# Altium project 2015_CNC.PrjPcb
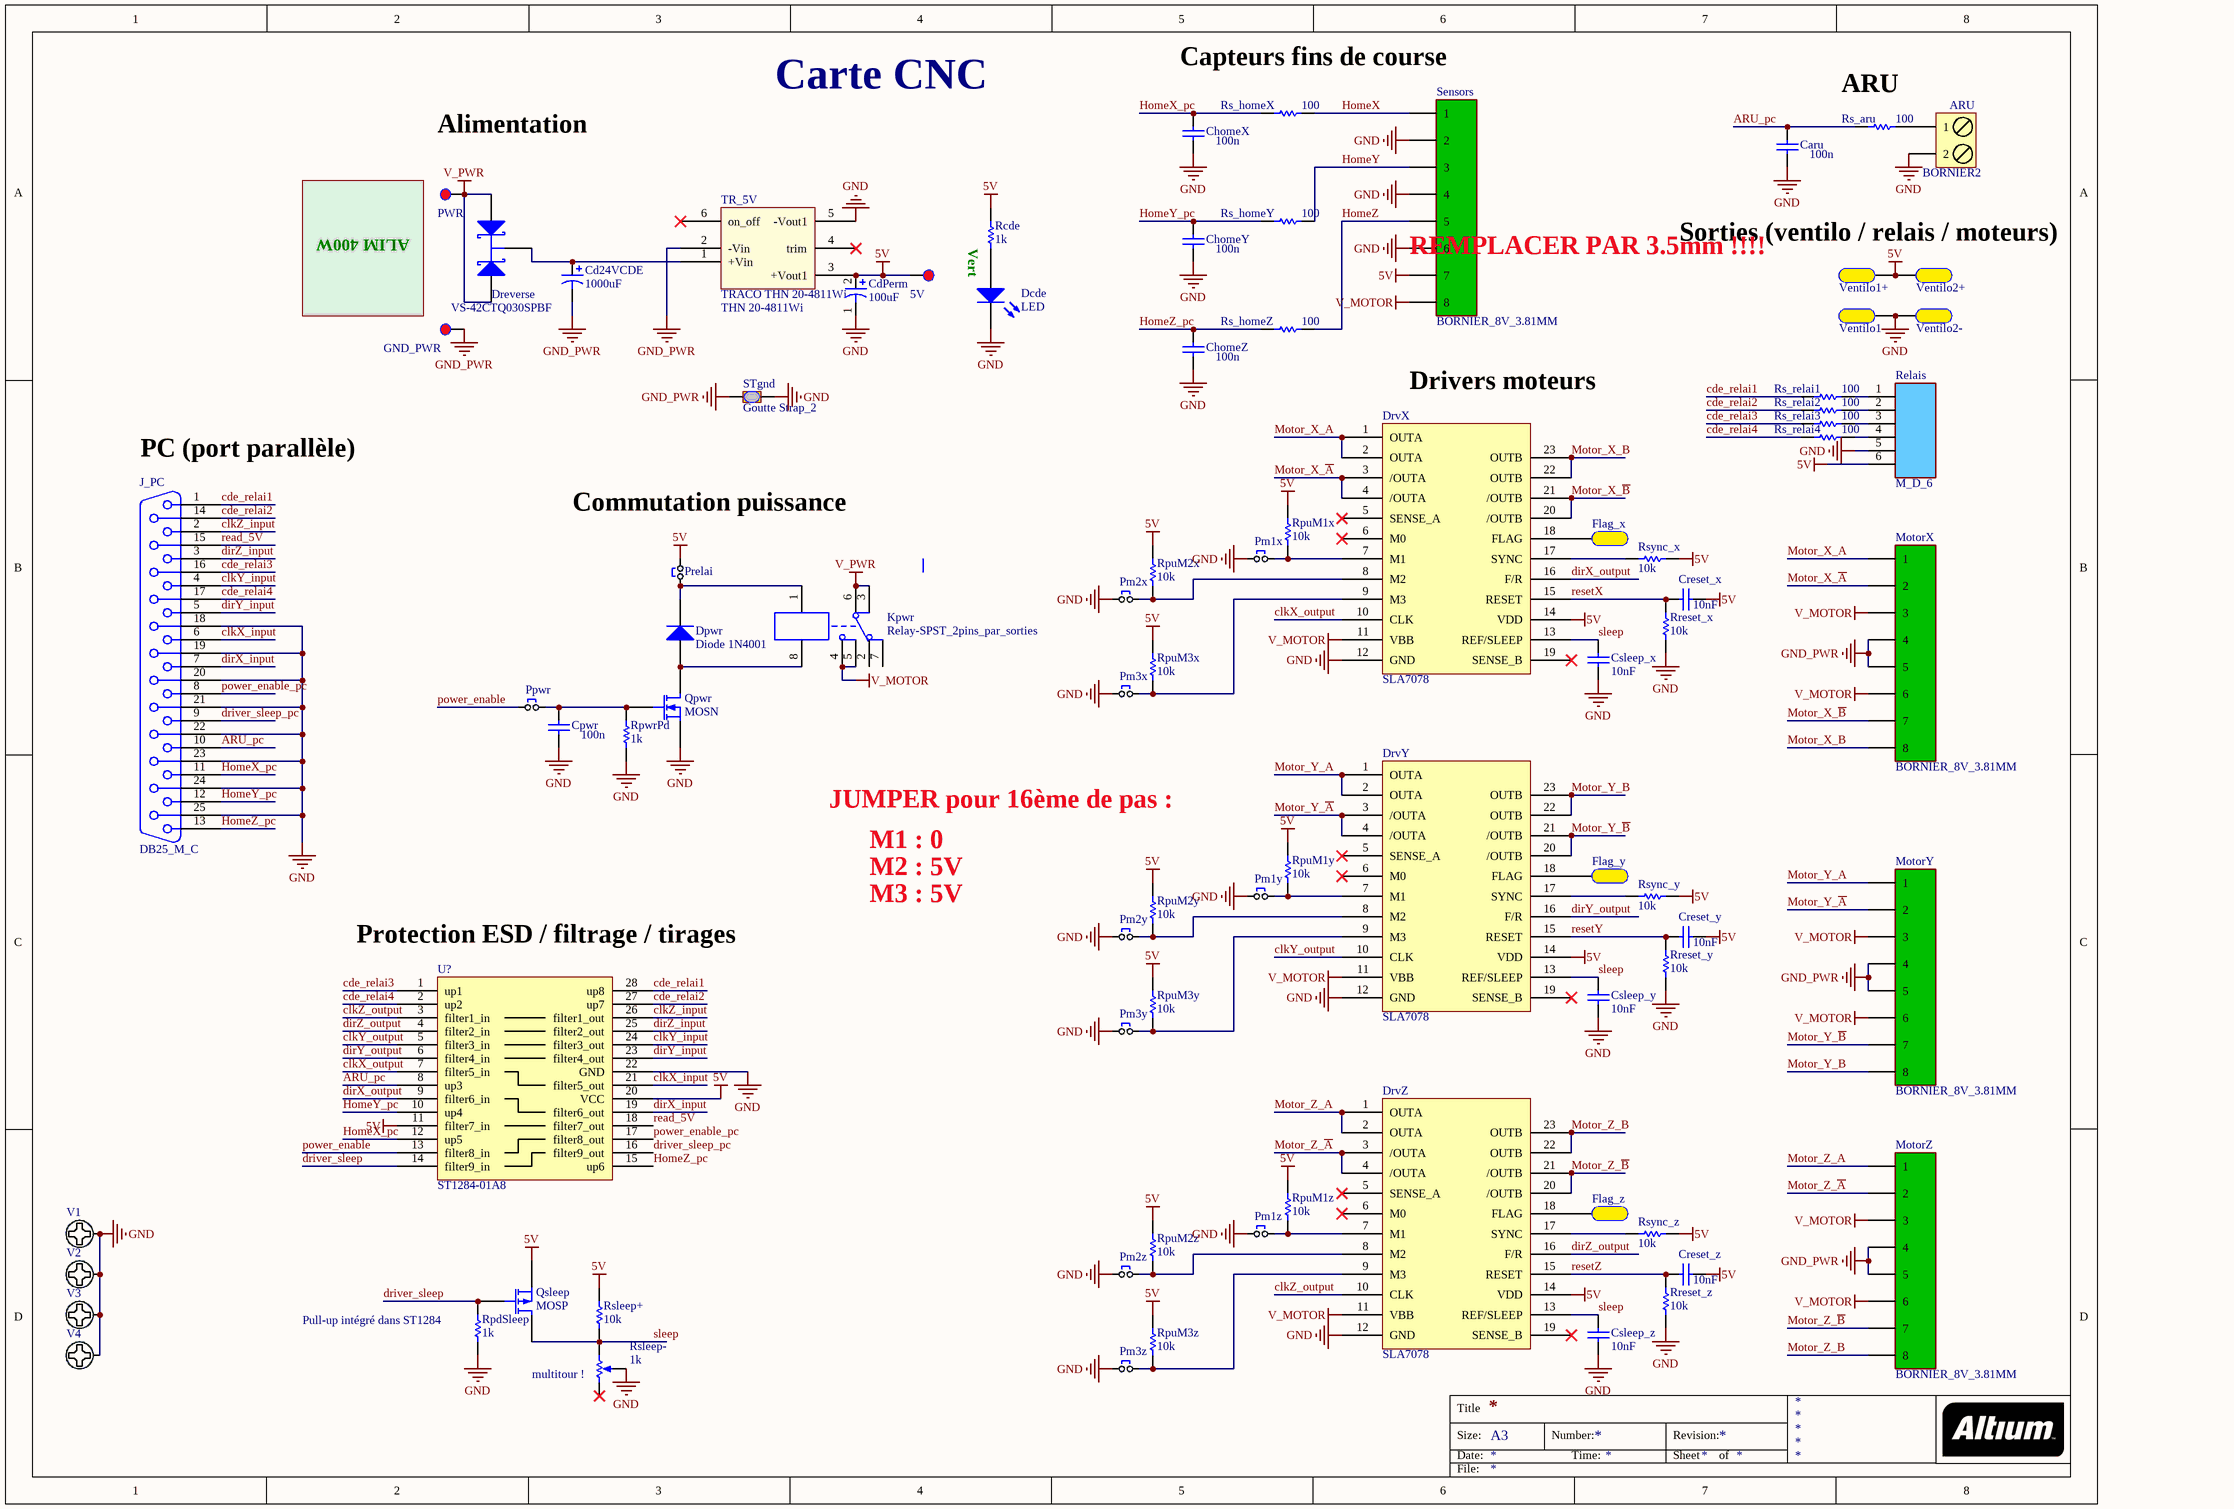
[diagram p0: 2015_CNC.SchDoc]
1 sheet, 85 parts. Net scope: global (net labels, ports and power ports of the same name join across sheets).
Board file: 2015_CNC.PcbDoc

## Sheet 2015_CNC.SchDoc
size A3

### Parts
5V  Name  [Point Test_D3_P1.6mm]  (value not drawn)
ARU  BORNIER2  [BORNIER2]
Caru  value 100n  [C0805_N]  (hidden comment: CMS_0805)
Cd24VCDE  1000uF  [RESISTANCE_5W]
CdPerm  100uF  [CONDENSATEUR_POLARISE_ELECTROLYTIQUE_RADIAL_5.08/8.9]
ChomeX  value 100n  [C0805_N]  (hidden comment: CMS_0805)
ChomeY  value 100n  [C0805_N]  (hidden comment: CMS_0805)
ChomeZ  value 100n  [C0805_N]  (hidden comment: CMS_0805)
Cpwr  value 100n  [C0805_N]  (hidden comment: CMS_0805)
Creset_x  value 10nF  [C0805_N]  (hidden comment: CMS_0805)
Creset_y  value 10nF  [C0805_N]  (hidden comment: CMS_0805)
Creset_z  value 10nF  [C0805_N]  (hidden comment: CMS_0805)
Csleep_x  value 10nF  [C0805_N]  (hidden comment: CMS_0805)
Csleep_y  value 10nF  [C0805_N]  (hidden comment: CMS_0805)
Csleep_z  value 10nF  [C0805_N]  (hidden comment: CMS_0805)
Dcde  LED  [LED_3mm]
Dpwr  Diode 1N4001  [DO-41]
Dreverse  VS-42CTQ030SPBF  [D2Pak (123)]
DrvX  SLA7078  [SLA23]
DrvY  SLA7078  [SLA23]
DrvZ  SLA7078  [SLA23]
Flag_x  Pad_CMS  [PAD_CMS_5.08x2.54]  (value not drawn)
Flag_y  Pad_CMS  [PAD_CMS_5.08x2.54]  (value not drawn)
Flag_z  Pad_CMS  [PAD_CMS_5.08x2.54]  (value not drawn)
GND_PWR  Name  [Point Test_D3_P1.6mm]  (value not drawn)
J_PC  Type: DB25_M_C  [SUBD25_M_C]  (hidden comment: SUBD25_MALE_COUDE)
Kpwr  Relay-SPST_2pins_par_sorties  [RELAY_TECONNECTIVITY]
MotorX  BORNIER_8V_3.81MM  [BORNIER_8V_3.81MM]
MotorY  BORNIER_8V_3.81MM  [BORNIER_8V_3.81MM]
MotorZ  BORNIER_8V_3.81MM  [BORNIER_8V_3.81MM]
Pm1x  Jumper SIP 2.54  [HDR1X2]  (value not drawn)
Pm1y  Jumper SIP 2.54  [HDR1X2]  (value not drawn)
Pm1z  Jumper SIP 2.54  [HDR1X2]  (value not drawn)
Pm2x  Jumper SIP 2.54  [HDR1X2]  (value not drawn)
Pm2y  Jumper SIP 2.54  [HDR1X2]  (value not drawn)
Pm2z  Jumper SIP 2.54  [HDR1X2]  (value not drawn)
Pm3x  Jumper SIP 2.54  [HDR1X2]  (value not drawn)
Pm3y  Jumper SIP 2.54  [HDR1X2]  (value not drawn)
Pm3z  Jumper SIP 2.54  [HDR1X2]  (value not drawn)
Ppwr  Jumper SIP 2.54  [HDR1X2]  (value not drawn)
Prelai  Jumper SIP 2.54  [HDR1X2]  (value not drawn)
PWR  Name  [Point Test_D3_P1.6mm]  (value not drawn)
Qpwr  MOSN  [SOT23-3N]
Qsleep  MOSP  [SOT23-3N]
Rcde  1k  [R1206_N]
Relais  Type: M_D_6  [HE10/6_MAL_DROIT_BAS PROFIL]  (hidden comment: BARRETTE_6 CONTACTS_1 RANGEE_MALE_DROITE)
RpdSleep  value 1k  [R1206_N]  (hidden comment: RESISTANCE_CMS_1206)
RpuM1x  value 10k  [R1206_N]  (hidden comment: RESISTANCE_CMS_1206)
RpuM1y  value 10k  [R1206_N]  (hidden comment: RESISTANCE_CMS_1206)
RpuM1z  value 10k  [R1206_N]  (hidden comment: RESISTANCE_CMS_1206)
RpuM2x  value 10k  [R1206_N]  (hidden comment: RESISTANCE_CMS_1206)
RpuM2y  value 10k  [R1206_N]  (hidden comment: RESISTANCE_CMS_1206)
RpuM2z  value 10k  [R1206_N]  (hidden comment: RESISTANCE_CMS_1206)
RpuM3x  value 10k  [R1206_N]  (hidden comment: RESISTANCE_CMS_1206)
RpuM3y  value 10k  [R1206_N]  (hidden comment: RESISTANCE_CMS_1206)
RpuM3z  value 10k  [R1206_N]  (hidden comment: RESISTANCE_CMS_1206)
RpwrPd  value 1k  [R1206_N]  (hidden comment: RESISTANCE_CMS_1206)
Rreset_x  value 10k  [R1206_N]  (hidden comment: RESISTANCE_CMS_1206)
Rreset_y  value 10k  [R1206_N]  (hidden comment: RESISTANCE_CMS_1206)
Rreset_z  value 10k  [R1206_N]  (hidden comment: RESISTANCE_CMS_1206)
Rs_aru  value 100  [R1206_N]  (hidden comment: RESISTANCE_CMS_1206)
Rs_homeX  value 100  [R1206_N]  (hidden comment: RESISTANCE_CMS_1206)
Rs_homeY  value 100  [R1206_N]  (hidden comment: RESISTANCE_CMS_1206)
Rs_homeZ  value 100  [R1206_N]  (hidden comment: RESISTANCE_CMS_1206)
Rs_relai1  value 100  [R1206_N]  (hidden comment: RESISTANCE_CMS_1206)
Rs_relai2  value 100  [R1206_N]  (hidden comment: RESISTANCE_CMS_1206)
Rs_relai3  value 100  [R1206_N]  (hidden comment: RESISTANCE_CMS_1206)
Rs_relai4  value 100  [R1206_N]  (hidden comment: RESISTANCE_CMS_1206)
Rsleep+  value 10k  [R1206_N]  (hidden comment: RESISTANCE_CMS_1206)
Rsleep-  1k  [POT_3150W_CMS a modifier]
Rsync_x  value 10k  [R1206_N]  (hidden comment: RESISTANCE_CMS_1206)
Rsync_y  value 10k  [R1206_N]  (hidden comment: RESISTANCE_CMS_1206)
Rsync_z  value 10k  [R1206_N]  (hidden comment: RESISTANCE_CMS_1206)
Sensors  BORNIER_8V_3.81MM  [BORNIER_8V_3.81MM]
STgnd  Goutte Strap_2  [Goutte Strap_2 Pads_Clearance 0.254mm]
TR_5V  TRACO THN 20-4811Wi  Ref: THN 20-4811Wi  [TRACO_THN20]
U?  ST1284-01A8  [QSOP28]
V1  Pad_M3  [M3x6mm]  (value not drawn)
V2  Pad_M3  [M3x6mm]  (value not drawn)
V3  Pad_M3  [M3x6mm]  (value not drawn)
V4  Pad_M3  [M3x6mm]  (value not drawn)
Ventilo1+  Pad_CMS  [PAD_CMS_5.08x2.54]  (value not drawn)
Ventilo1-  Pad_CMS  [PAD_CMS_5.08x2.54]  (value not drawn)
Ventilo2+  Pad_CMS  [PAD_CMS_5.08x2.54]  (value not drawn)
Ventilo2-  Pad_CMS  [PAD_CMS_5.08x2.54]  (value not drawn)

### Nets
5V: 5V.1 CdPerm.2 Creset_x.1 Creset_y.1 Creset_z.1 DrvX.14(VDD) DrvY.14(VDD) DrvZ.14(VDD) Prelai.2 Qsleep.3(S) Rcde.1 Relais.6 RpuM1x.2 RpuM1y.2 RpuM1z.2 RpuM2x.2 RpuM2y.2 RpuM2z.2 RpuM3x.2 RpuM3y.2 RpuM3z.2 Rsleep+.2 Rsync_x.1 Rsync_y.1 Rsync_z.1 Sensors.7 TR_5V.3(+Vout1) U?.11(filter7_in) U?.20(VCC) Ventilo1+.1 Ventilo2+.1
GND: ARU.2 Caru.1 CdPerm.1 ChomeX.1 ChomeY.1 ChomeZ.1 Cpwr.1 Csleep_x.2 Csleep_y.2 Csleep_z.2 Dcde.2(K) DrvX.12(GND) DrvY.12(GND) DrvZ.12(GND) J_PC.18 J_PC.19 J_PC.20 J_PC.21 J_PC.22 J_PC.23 J_PC.24 J_PC.25 Pm1x.1 Pm1y.1 Pm1z.1 Pm2x.1 Pm2y.1 Pm2z.1 Pm3x.1 Pm3y.1 Pm3z.1 Qpwr.2(S) Relais.5 RpdSleep.1 RpwrPd.1 Rreset_x.2 Rreset_y.2 Rreset_z.2 Rsleep-.2(TAP) Sensors.2 Sensors.4 Sensors.6 STgnd.2 TR_5V.5(-Vout1) U?.22(GND) V1.1 V2.1 V3.1 V4.1 Ventilo1-.1 Ventilo2-.1
GND_PWR: Cd24VCDE.1 GND_PWR.1 MotorX.4 MotorX.5 MotorY.4 MotorY.5 MotorZ.4 MotorZ.5 STgnd.1 TR_5V.2(-Vin)
V_MOTOR: DrvX.11(VBB) DrvY.11(VBB) DrvZ.11(VBB) Kpwr.4 Kpwr.5 MotorX.3 MotorX.6 MotorY.3 MotorY.6 MotorZ.3 MotorZ.6 Sensors.8
V_PWR: Dreverse.1(A1) Dreverse.3(A2) Kpwr.3 Kpwr.6 PWR.1
ARU_pc: Caru.2 J_PC.10 Rs_aru.1 U?.8(up3)
cde_relai1: J_PC.1 Rs_relai1.1 U?.28(up8)
cde_relai2: J_PC.14 Rs_relai2.1 U?.27(up7)
cde_relai3: J_PC.16 Rs_relai3.1 U?.1(up1)
cde_relai4: J_PC.17 Rs_relai4.1 U?.2(up2)
clkX_input: J_PC.6 U?.21(filter5_out)
clkX_output: DrvX.10(CLK) U?.7(filter5_in)
clkY_input: J_PC.4 U?.24(filter3_out)
clkY_output: DrvY.10(CLK) U?.5(filter3_in)
clkZ_input: J_PC.2 U?.26(filter1_out)
clkZ_output: DrvZ.10(CLK) U?.3(filter1_in)
dirX_input: J_PC.7 U?.19(filter6_out)
dirX_output: DrvX.16(F/R) U?.9(filter6_in)
dirY_input: J_PC.5 U?.23(filter4_out)
dirY_output: DrvY.16(F/R) U?.6(filter4_in)
dirZ_input: J_PC.3 U?.25(filter2_out)
dirZ_output: DrvZ.16(F/R) U?.4(filter2_in)
driver_sleep: Qsleep.2(G) RpdSleep.2 U?.14(filter9_in)
driver_sleep_pc: J_PC.9 U?.16(filter9_out)
HomeX: Rs_homeX.2 Sensors.1
HomeX_pc: ChomeX.2 J_PC.11 Rs_homeX.1 U?.12(up5)
HomeY: Rs_homeY.2 Sensors.3
HomeY_pc: ChomeY.2 J_PC.12 Rs_homeY.1 U?.10(up4)
HomeZ: Rs_homeZ.2 Sensors.5
HomeZ_pc: ChomeZ.2 J_PC.13 Rs_homeZ.1 U?.15(up6)
Motor_X_A: DrvX.1(OUTA) DrvX.2(OUTA) MotorX.1
Motor_X_~{A}: DrvX.3(/OUTA) DrvX.4(/OUTA) MotorX.2
Motor_X_B: DrvX.22(OUTB) DrvX.23(OUTB) MotorX.8
Motor_X_~{B}: DrvX.20(/OUTB) DrvX.21(/OUTB) MotorX.7
Motor_Y_A: DrvY.1(OUTA) DrvY.2(OUTA) MotorY.1
Motor_Y_~{A}: DrvY.3(/OUTA) DrvY.4(/OUTA) MotorY.2
Motor_Y_B: DrvY.22(OUTB) DrvY.23(OUTB) MotorY.8
Motor_Y_~{B}: DrvY.20(/OUTB) DrvY.21(/OUTB) MotorY.7
Motor_Z_A: DrvZ.1(OUTA) DrvZ.2(OUTA) MotorZ.1
Motor_Z_~{A}: DrvZ.3(/OUTA) DrvZ.4(/OUTA) MotorZ.2
Motor_Z_B: DrvZ.22(OUTB) DrvZ.23(OUTB) MotorZ.8
Motor_Z_~{B}: DrvZ.20(/OUTB) DrvZ.21(/OUTB) MotorZ.7
power_enable: Ppwr.1 U?.13(filter8_in)
power_enable_pc: J_PC.8 U?.17(filter8_out)
read_5V: J_PC.15 U?.18(filter7_out)
resetX: Creset_x.2 DrvX.15(RESET) Rreset_x.1
resetY: Creset_y.2 DrvY.15(RESET) Rreset_y.1
resetZ: Creset_z.2 DrvZ.15(RESET) Rreset_z.1
sleep: Csleep_x.1 Csleep_y.1 Csleep_z.1 DrvX.13(REF/SLEEP) DrvY.13(REF/SLEEP) DrvZ.13(REF/SLEEP) Qsleep.1(D) Rsleep+.1 Rsleep-.3(BOT)
NetARU_1: ARU.1 Rs_aru.2
NetCd24VCDE_2: Cd24VCDE.2 Dreverse.2(K) TR_5V.1(+Vin)
NetCpwr_2: Cpwr.2 Ppwr.2 Qpwr.1(G) RpwrPd.2
NetDcde_1: Dcde.1(A) Rcde.2
NetDpwr_1: Dpwr.1(A) Kpwr.8 Qpwr.3(D)
NetDpwr_2: Dpwr.2(K) Kpwr.1 Prelai.1
NetDrvX_7: DrvX.7(M1) Pm1x.2 RpuM1x.1
NetDrvX_8: DrvX.8(M2) Pm2x.2 RpuM2x.1
NetDrvX_9: DrvX.9(M3) Pm3x.2 RpuM3x.1
NetDrvX_17: DrvX.17(SYNC) Rsync_x.2
NetDrvX_18: DrvX.18(FLAG) Flag_x.1
NetDrvY_7: DrvY.7(M1) Pm1y.2 RpuM1y.1
NetDrvY_8: DrvY.8(M2) Pm2y.2 RpuM2y.1
NetDrvY_9: DrvY.9(M3) Pm3y.2 RpuM3y.1
NetDrvY_17: DrvY.17(SYNC) Rsync_y.2
NetDrvY_18: DrvY.18(FLAG) Flag_y.1
NetDrvZ_7: DrvZ.7(M1) Pm1z.2 RpuM1z.1
NetDrvZ_8: DrvZ.8(M2) Pm2z.2 RpuM2z.1
NetDrvZ_9: DrvZ.9(M3) Pm3z.2 RpuM3z.1
NetDrvZ_17: DrvZ.17(SYNC) Rsync_z.2
NetDrvZ_18: DrvZ.18(FLAG) Flag_z.1
NetRelais_1: Relais.1 Rs_relai1.2
NetRelais_2: Relais.2 Rs_relai2.2
NetRelais_3: Relais.3 Rs_relai3.2
NetRelais_4: Relais.4 Rs_relai4.2

Not connected (* = marked no-connect by the designer): DrvX 5(SENSE_A)* 6(M0)* 19(SENSE_B)*; DrvY 5(SENSE_A)* 6(M0)* 19(SENSE_B)*; DrvZ 5(SENSE_A)* 6(M0)* 19(SENSE_B)*; Kpwr 2 7; Rsleep- 1(TOP)*; TR_5V 4(trim)* 6(on_off)*

### Notes on the sheet
- Carte CNC
- Capteurs fins de course
- (near Rs_aru) ARU
- Alimentation
- ALIM 400W
- Vert
- Sorties (ventilo / relais / moteurs)
- (near Sensors) REMPLACER PAR 3.5mm !!!!
- Drivers moteurs
- (near J_PC) PC (port parallèle)
- (near Prelai) Commutation puissance
- JUMPER pour 16ème de pas :
- M1 : 0
- M2 : 5V
- M3 : 5V
- (near U?) Protection ESD / filtrage / tirages
- (near RpdSleep) Pull-up intégré dans ST1284
- (near Rsleep-) multitour !
- Title
- Size:
- Date:
- A3
- Number:
- Time:
- Revision:
- Sheet
- of
- File:

### Library data of the parts
5V GND_PWR PWR = Point Test: Publisher: Damien GUITTON
ARU = BORNIER2: Terminal blocks, 2 pins, pitch=5mm
Caru ChomeX ChomeY ChomeZ Cpwr Creset_x Creset_y Creset_z Csleep_x Csleep_y Csleep_z = CONDENSATEUR_CMS_CER_0805: CONDENSATEUR CMS CERAMIQUE 0805
Cd24VCDE CdPerm = Condensateur Polarise Traversant: Polarized Capacitor
Dcde = LED: Typical LED; Published: 8-Jun-2000; LatestRevisionDate: 08-Jul-2005; LatestRevisionNote: Mech Layer 1 removed.; PackageReference: LED-1; Publisher: Altium Limited
Dpwr = Diode 1N4001: 1 Amp General Purpose Rectifier; Published: 8-Jun-2000; LatestRevisionDate: 17-Jul-2002; LatestRevisionNote: Re-released for DXP Platform.; DatasheetVersion: 1998; PackageVersion: Aug-1999; PackageReference: DO-41; Publisher: Altium Limited; PackageDescription: Diode, Axial; Body 5.2 x 2.7 mm (LxDia. max), Lead Dia. 0.86 mm (max); Code_JEDEC: DO-204-AL; ComponentLink1Description: Manufacturer Link; ComponentLink1URL: http://www.fairchildsemi.com/; ComponentLink2Description: Datasheet; ComponentLink2URL: http://www.fairchildsemi.com/ds/1N%2F1N4001.pdf
Dreverse = Diode Shottky double BAT54C: DIODE SCHOTTKY DOUBLE; Manufacturer Part Number: BAT54C; Manufacturer: ZETEX; Diode Case Style: SOT-23; Supplier Part Number: 9526501; Supplier: Farnell; ComponentLink1URL: http://www.farnell.com/datasheets/27632.pdf; ComponentLink1Description: http://www.farnell.com/datasheets/27632.pdf; Pricing: 5=0,32, 25=0,23, 100=0,198, 1000=0,154 (EUR); RoHS: YES
Flag_x Flag_y Flag_z Ventilo1+ Ventilo1- Ventilo2+ Ventilo2- = Pad_CMS: Pad pour souder un fil; LatestRevisionNote: Mech Layer 1 removed.; PackageReference: PAD_CMS; Publisher: Damien Guitton
J_PC = SUBD25_MALE_COUDE: CONNECTEUR SUBD25 MALE COUDE
Kpwr = Relay-SPST_2pins_par_sorties: OZ-SS-105LM1,200 - Single-Pole Single-Throw Relay; Published: 24-Mar-1999; LatestRevisionDate: 17-Jul-2002; LatestRevisionNote: Re-released for DXP Platform.; PackageReference: MODULE4; Publisher: Altium Limited
Pm1x Pm1y Pm1z Pm2x Pm2y Pm2z Pm3x Pm3y Pm3z Ppwr Prelai = Jumper SIP2.54
Qpwr = Transistor MOSFET-N: N-Channel MOSFET; PackageDocument: 1995/1996; Published: 8-Jun-2000; LatestRevisionDate: 17-Jul-2002; LatestRevisionNote: Re-released for DXP Platform.; PackageReference: E3; Publisher: Altium Limited
Qsleep = Transistor MOSFET-P: P-Channel MOSFET; PackageDocument: 1995/1996; Published: 8-Jun-2000; LatestRevisionDate: 17-Jul-2002; LatestRevisionNote: Re-released for DXP Platform.; PackageReference: E3; Publisher: Altium Limited
Rcde = Resistor: Published: 8-Jun-2000; LatestRevisionDate: 17-Jul-2002; LatestRevisionNote: Re-released for DXP Platform.; PackageReference: AXIAL-0.5; Publisher: Altium Limited
Relais = BARRETTE_6 CONTACTS_1 RANGEE_MALE_DROITE: BARRETTE 6 CONTACTS 1 RANGEE MALE DROITE
RpdSleep RpuM1x RpuM1y RpuM1z RpuM2x RpuM2y RpuM2z RpuM3x RpuM3y RpuM3z RpwrPd Rreset_x Rreset_y Rreset_z Rs_aru Rs_homeX Rs_homeY Rs_homeZ Rs_relai1-Rs_relai4 Rsleep+ Rsync_x Rsync_y Rsync_z = RESISTANCE_CMS_0805: RESISTANCE CMS 1206
Rsleep- = Resistor Ajustable: Sim Note: Enter the Resistance value and the set point into parameter fields.; Set Position: 0.5; Published: 8-Jun-2000; LatestRevisionDate: 17-Jul-2002; LatestRevisionNote: Re-released for DXP Platform.; PackageReference: VR5; Publisher: Altium Limited
TR_5V = TRACO THN 20-4811Wi: Traco 20W 24V to 5V*4A
U? = ST1284-01A8: Parallel port single termination network with ±15 kV ESD protection
V1-V4 = Vis M3 X 6mm _TORX_Tête 6mm: Publisher: Damien Guitton
STgnd = Goutte Strap_2: LatestRevisionDate: 30/01/11; Publisher: Damien Guitton